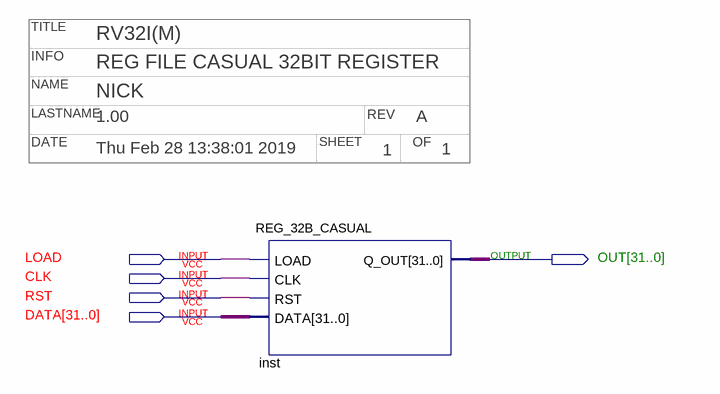
[diagram p0: schematic sheet]
// Quartus schematic REG_32B_CASUALTEST.bdf as structural Verilog: 1 symbols, 5 pins
// Title block: TITLE: RV32I(M); INFO: REG FILE CASUAL 32BIT REGISTER; NAME: NICK; LASTNAME: 1.00; REV: A; DATE: Thu Feb 28 13:38:01 2019; SHEET: 1; OF: 1
module REG_32B_CASUALTEST (
  input  LOAD,
  input  CLK,
  input  RST,
  input  [31:0] DATA,
  output [31:0] OUT
);

  REG_32B_CASUAL inst (.LOAD(LOAD), .CLK(CLK), .RST(RST), .DATA(DATA), .Q_OUT(OUT));
endmodule
